# Altium project BACKUP_POWER.PrjPCB
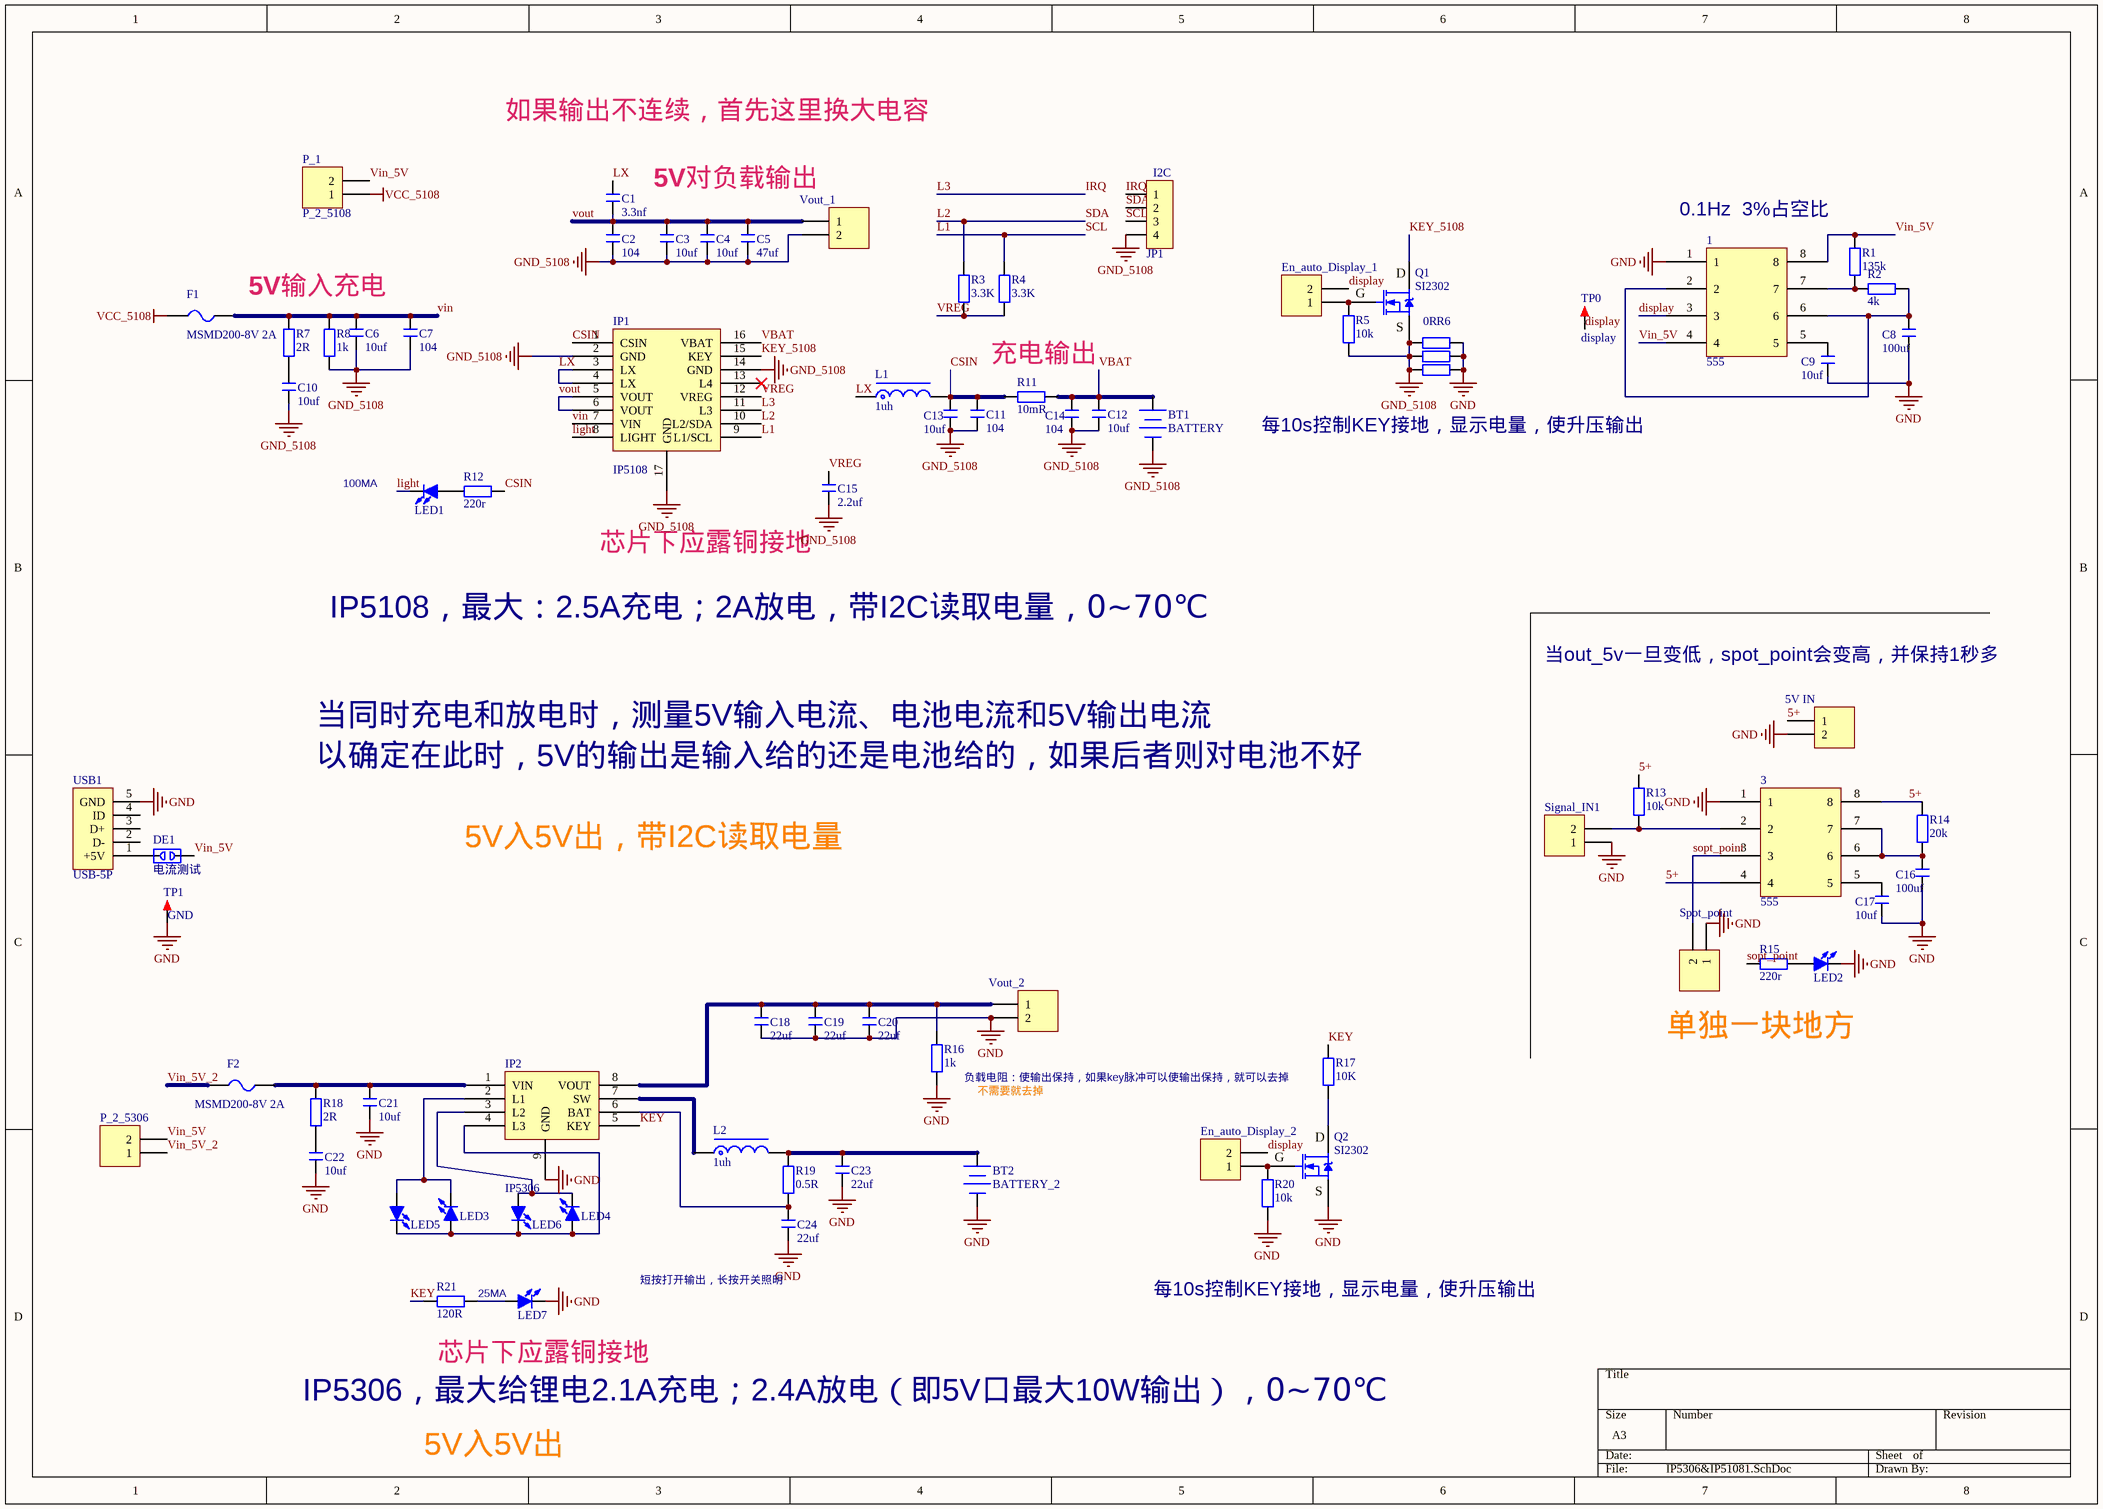
[diagram p0: IP5306&IP51081.SchDoc]
1 sheet, 78 parts. Net scope: global (net labels, ports and power ports of the same name join across sheets).
Board files: BACKUP_POWER.PcbDoc, IP5306&IP5108.PcbDoc, 拼版.PcbDoc

## Sheet IP5306&IP51081.SchDoc
size A3

### Parts
1  555  [SOP8_N]
2  5V IN  [HDR1X2]
3  555  [SOP8_N]
BT1  BATTERY  [BAT-2]
BT2  BATTERY_2  [BAT-2]
C1  3.3nf  [C 0805_M]
C2  104  [C 0805_M]
C3  10uf  [C 0805_M]
C4  10uf  [C 0805_M]
C5  47uf  [CD A(3216)]
C6  10uf  [C 0805_M]
C7  104  [C 0805_M]
C8  100uf  [CD B(3528)]
C9  10uf  [C 0805_M]
C10  10uf  [C 0805_M]
C11  104  [C 0805_M]
C12  10uf  [C 0805_M]
C13  10uf  [C 0805_M]
C14  104  [C 0805_M]
C15  2.2uf  [C 0805_M]
C16  100uf  [CD B(3528)]
C17  10uf  [C 0805_M]
C18  22uf  [C 0805_M]
C19  22uf  [C 0805_M]
C20  22uf  [C 0805_M]
C21  10uf  [C 0805_M]
C22  10uf  [C 0805_M]
C23  22uf  [C 0805_M]
C24  22uf  [C 0805_M]
DE1  电流测试  [DEBUG_B]
En_auto_Display_1  En_auto_Display_1  [HDR1X2]
En_auto_Display_2  En_auto_Display_2  [HDR1X2]
F1  MSMD200-8V 2A  [FU 1812]
F2  MSMD200-8V 2A  [FU 1812]
IP1  IP5108  [ESOP16_M]
IP2  IP5306  [ESOP8_M]
JP1  I2C  [HDR2.54-LI-4P]
L1  1uh  [L-SMD-0630]
L2  1uh  [L-SMD-0630]
LED1  light  [LED 0805G]  (value not drawn)
LED2  led  [LED 0805G]  (value not drawn)
LED3  led2  [LED 0805G]  (value not drawn)
LED4  led4  [LED 0805G]  (value not drawn)
LED5  led1  [LED 0805G]  (value not drawn)
LED6  led3  [LED 0805G]  (value not drawn)
LED7  light  [LED 0805G]  (value not drawn)
P_1  P_2_5108  [HDR1X2]
P_2  P_2_5306  [HDR1X2]
Q1  SI2302  [SOT23-3N]
Q2  SI2302  [SOT23-3N]
R1  135k  [R 0805_M]
R2  4k  [R 0805_M]
R3  3.3K  [R 0805_M]
R4  3.3K  [R 0805_M]
R5  10k  [R 0805_M]
R6  0R  [R 0805_M]
R7  2R  [R 0805_M]
R8  1k  [R 0805_M]
R9  0R  [R 0805_M]  (value not drawn)
R10  0R  [R 0805_M]  (value not drawn)
R11  10mR  [R 2512-HP_L]
R12  220r  [R 0805_M]
R13  10k  [R 0805_M]
R14  20k  [R 0805_M]
R15  220r  [R 0805_M]
R16  1k  [R 0805_M]
R17  10K  [R 0805_M]
R18  2R  [R 0805_M]
R19  0.5R  [R 0805_M]
R20  10k  [R 0805_M]
R21  120R  [R 0805_M]
Signal_IN1  Signal_IN1  [HDR1X2]
Spot_point1  Spot_point  [HDR1X2]
TP0  display  [TEST 1]
TP1  GND  [TEST 1]
USB1  USB-5P  [USB-MICRO_E]
Vout_1  Vout_1  [HDR1X2]
Vout_2  Vout_2  [HDR1X2]

### Nets
GND: 1.1 2.2 3.1 BT2.2(-) C8.1 C9.1 C16.1 C17.1 C18.1 C19.1 C20.1 C21.1 C22.1 C23.1 C24.1 IP2.9(GND) LED2.2(K) LED7.2(K) Q2.2(S) R6.2 R9.2 R10.2 R16.2 R20.2 Signal_IN1.1 Spot_point1.1 TP1.1 USB1.5(GND) Vout_2.2
GND_5108: BT1.2(-) C2.1 C3.1 C4.1 C5.1 C6.1 C7.1 C10.1 C11.1 C12.1 C13.1 C14.1 C15.1 IP1.2(GND) IP1.14(GND) IP1.17(GND) JP1.4 Q1.2(S) R5.2 R6.1 R8.2 R9.1 R10.1 Vout_1.2
VCC_5108: F1.1 P_1.1
5+: 2.1 3.4 3.8 R13.1 R14.1
CSIN: C11.2 C13.2 IP1.1(CSIN) L1.2 R11.1 R12.2
display: 1.3 En_auto_Display_1.2 En_auto_Display_2.2 TP0.1
IRQ: IP1.11(L3) JP1.1  [also labelled L3]
KEY: IP2.5(KEY) R17.1 R21.1
KEY_5108: IP1.15(KEY) Q1.3(D)
L1: IP1.9(L1/SCL) JP1.3 R4.1  [also labelled SCL]
L2: IP1.10(L2/SDA) JP1.2 R3.1  [also labelled SDA]
light: IP1.8(LIGHT) LED1.2(K)
LX: C1.2 IP1.3(LX) IP1.4(LX) L1.1
sopt_point: 3.3 R15.2 Spot_point1.2
VBAT: BT1.1(+) C12.2 C14.2 IP1.16(VBAT) R11.2
vin: C6.2 C7.2 F1.2 IP1.7(VIN) R7.1 R8.1
Vin_5V: 1.4 1.8 DE1.2 P_1.2 P_2.2 R1.2
Vin_5V_2: F2.1 P_2.1
vout: C1.1 C2.2 C3.2 C4.2 C5.2 IP1.5(VOUT) IP1.6(VOUT) Vout_1.1
VREG: C15.2 IP1.12(VREG) R3.2 R4.2
Net1_2: 1.2 1.6 C8.2 R2.1
Net1_5: 1.5 C9.2
Net1_7: 1.7 R1.1 R2.2
Net3_2: 3.2 R13.2 Signal_IN1.2
Net3_5: 3.5 C17.2
Net3_6: 3.6 3.7 C16.2 R14.2
NetBT2_1: BT2.1(+) C23.2 L2.2 R19.1
NetC10_2: C10.2 R7.2
NetC18_2: C18.2 C19.2 C20.2 IP2.8(VOUT) R16.1 Vout_2.1
NetC21_2: C21.2 F2.2 IP2.1(VIN) R18.1
NetC22_2: C22.2 R18.2
NetC24_2: C24.2 IP2.6(BAT) R19.2
NetDE1_1: DE1.1 USB1.1(+5V)
NetEn_auto_Display_1_1: En_auto_Display_1.1 Q1.1(G) R5.1
NetEn_auto_Display_2_1: En_auto_Display_2.1 Q2.1(G) R20.1
NetIP2_2: IP2.2(L1) LED3.2(K) LED5.1(A)
NetIP2_3: IP2.3(L2) LED4.2(K) LED6.1(A)
NetIP2_4: IP2.4(L3) LED3.1(A) LED4.1(A) LED5.2(K) LED6.2(K)
NetIP2_7: IP2.7(SW) L2.1
NetLED1_1: LED1.1(A) R12.1
NetLED2_1: LED2.1(A) R15.1
NetLED7_1: LED7.1(A) R21.2
NetQ2_3: Q2.3(D) R17.2

Not connected (* = marked no-connect by the designer): IP1 13(L4)*; USB1 2(D-) 3(D+) 4(ID)

### Notes on the sheet
- 如果输出不连续，首先这里换大电容
- 5V对负载输出
- 0.1Hz  3%占空比
- 5V输入充电
- 充电输出
- 每10s控制KEY接地，显示电量，使升压输出
- (near LED1) 100MA
- 芯片下应露铜接地
- IP5108，最大：2.5A充电；2A放电，带I2C读取电量，0~70℃
- 当out_5v一旦变低，spot_point会变高，并保持1秒多
- 当同时充电和放电时，测量5V输入电流、电池电流和5V输出电流
- 以确定在此时，5V的输出是输入给的还是电池给的，如果后者则对电池不好
- 5V入5V出，带I2C读取电量
- 单独一块地方
- (near R16) 负载电阻：使输出保持，如果key脉冲可以使输出保持，就可以去掉
- 不需要就去掉
- 25MA
- 短按打开输出，长按开关照明
- IP5306，最大给锂电2.1A充电；2.4A放电（即5V口最大10W输出），0~70℃
- 5V入5V出

### Library data of the parts
2 En_auto_Display_1 En_auto_Display_2 P_1 P_2 Signal_IN1 Spot_point1 Vout_1 Vout_2 = Header 2: Header, 2-Pin; LatestRevisionDate: 17-Jul-2002; LatestRevisionNote: Re-released for DXP Platform.; Publisher: Altium Limited
BT1 BT2 = BATTERY: Multicell Battery; Published: 24-Mar-1999; LatestRevisionDate: 17-Jul-2002; LatestRevisionNote: Re-released for DXP Platform.; PackageReference: BAT-2; Publisher: Altium Limited
C1-C24 = C: 无极性贴片电容; 版权归属: 源创客; BOM名称: 无极性贴片电容; 学习资源: www.ooocke.com
DE1 = DEBUG: 调试断点焊盘; 版权归属: 源创客; BOM名称: 调试断点焊盘; 学习资源: www.ooocke.com
F1 F2 = FU: 贴片保险丝; 版权归属: 源创客; BOM名称: 贴片保险丝; 学习资源: www.ooocke.com
JP1 = Header 4: 4P接插件; 版权归属: 源创客; BOM名称: 4P接插件; 学习资源: www.ooocke.com
L1 L2 = L-CDRH: 功率屏蔽电感; 版权归属: 源创客; BOM名称: 功率屏蔽电感; 学习资源: www.ooocke.com
LED1-LED7 = LED-SMD: 贴片LED; 版权归属: 源创客; BOM名称: 贴片LED; 学习资源: www.ooocke.com
Q1 Q2 = SI2302: N沟道场效应管; 版权归属: 源创客; BOM名称: N沟道场效应管; 学习资源: www.ooocke.com
R1-R21 = R: 贴片电阻; 版权归属: 源创客; BOM名称: 贴片电阻; 学习资源: www.ooocke.com
TP0 TP1 = TEST: 测试点; 版权归属: 源创客; BOM名称: 测试点; 学习资源: www.ooocke.com
USB1 = USB-5P: 微型USB母座; 版权归属: 源创客; BOM名称: 微型USB母座; 学习资源: www.ooocke.com